# EAGLE schematic cv-pots (EAGLE 9.5.2)
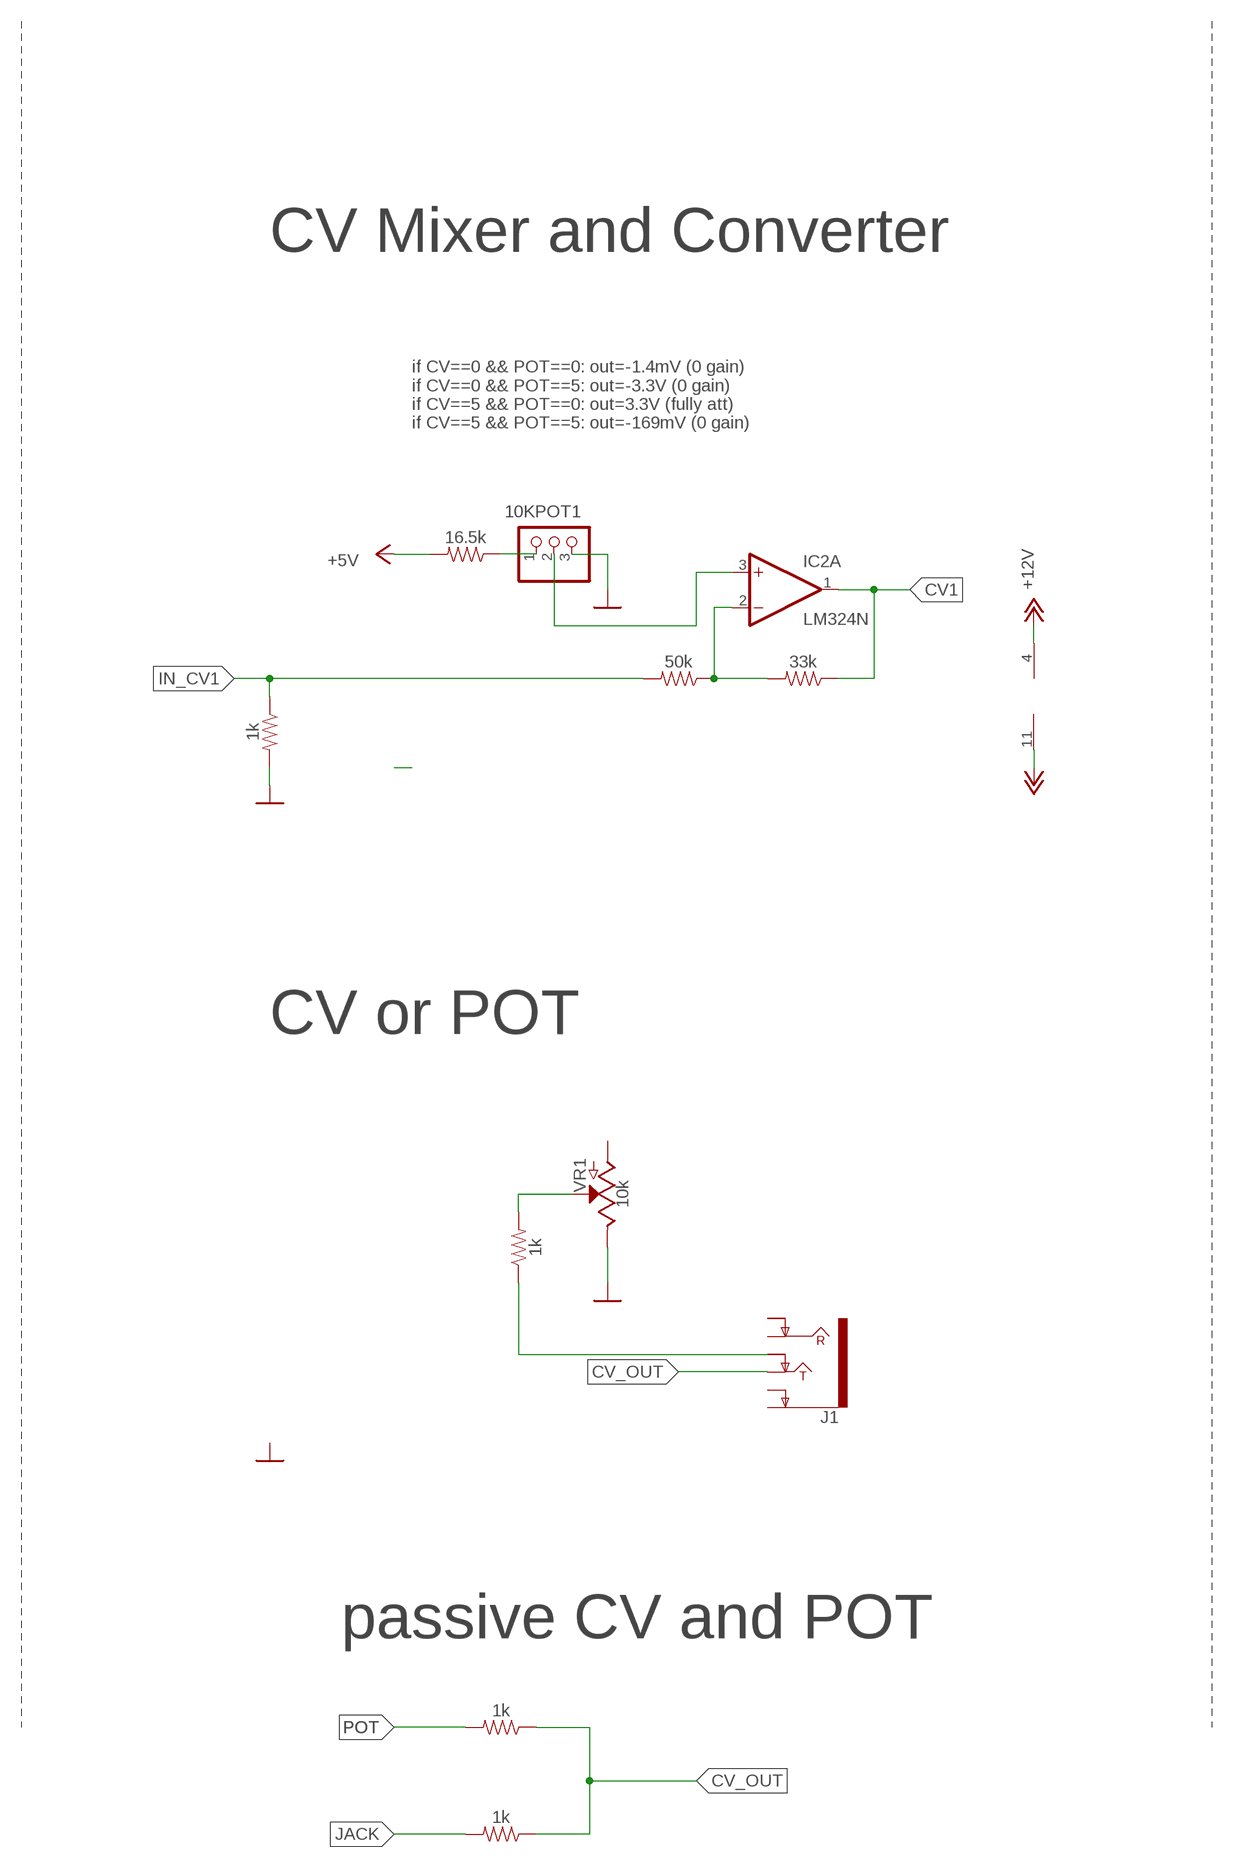
[diagram p0: schematic, sheet 1]

## Parts
10KPOT1  PINHD-1X3  [1X03]
IC2  LM324N  [DIL14]
J1  AUDIO_JACK_TRS_0.25"_PTH_RA  [AUDIO_JACK_0.25"_TRS_PTH_RA]
R1  1k  RESISTORAXIAL-0.3  [AXIAL-0.3]
R2  1k  RESISTORAXIAL-0.3  [AXIAL-0.3]
R3  1k  RESISTORAXIAL-0.3  [AXIAL-0.3]
R9  1k  RESISTORAXIAL-0.3  [AXIAL-0.3]
R18  16.5k  RESISTORAXIAL-0.3  [AXIAL-0.3]
R19  50k  RESISTORAXIAL-0.3  [AXIAL-0.3]
R20  33k  RESISTORAXIAL-0.3  [AXIAL-0.3]
VR1  10k  POTENTIOMETER-PTH-9MM-1/20W-20%  [POT-PTH-ALPS]

## Nets
+5V: R18.P$2
+12V: IC2.4(P:V+)
-12V: IC2.11(P:V-)
CV1: IC2.1(A:OUT) R20.P$1
CV_OUT: J1.TIP R2.P$1 R3.P$1
GND: 10KPOT1.3 R9.P$2 VR1.P$1(E)
IN_CV1: R9.P$1 R19.P$2
JACK: R3.P$2
N$2: R1.P$2 VR1.P$2(S)
N$3: J1.TIP-NORM R1.P$1
N$15: 10KPOT1.2 IC2.3(A:+IN)
N$16: 10KPOT1.1 R18.P$1
N$17: IC2.2(A:-IN) R19.P$1 R20.P$2
POT: R2.P$2
Unconnected: IC2.5(B:+IN) IC2.6(B:-IN) IC2.7(B:OUT) IC2.8(C:OUT) IC2.9(C:-IN) IC2.10(C:+IN) IC2.12(D:+IN) IC2.13(D:-IN) IC2.14(D:OUT) J1.RING J1.RING-NORM J1.SLEEVE(EARTH) J1.SLEEVE-NORM(EARTH-NORM) VR1.P$3(A)

## Notes on the sheet
- CV Mixer and Converter
- if CV==0 && POT==0: out=-1.4mV (0 gain)
  if CV==0 && POT==5: out=-3.3V (0 gain)
  if CV==5 && POT==0: out=3.3V (fully att)
  if CV==5 && POT==5: out=-169mV (0 gain)
- CV or POT
- passive CV and POT

## Library data of the parts
10KPOT1 = pinhead:PINHD-1X3: PIN HEADER
IC2 = linear:LM324: OP AMP
J1 = SparkFun-Connectors:AUDIO_JACK_TRS_0.25"_PTH_RA: Audio Jack, 1/4" TRS jack, horizontal, PTH, aka "Phono jack" Find the connector here: Audio Jack - 1/4" Stereo (right angle) <https://www.sparkfun.com/products/11144> (COM-11144) Datasheet <http://cdn.sparkfun.com/datasheets/Components/General/JP-611%20DD.jpg> Note, although the datasheet and physical part are slightly different, this footprint was proven to mate well on the Proto Pedal. This device is used on these SparkFun Products: SparkFun TRS Jack Breakout - 1/4" Stereo <https://www.sparkfun.com/products/13005> (BOB-13005 ) SparkFun Proto Pedal - sorry bad link - product comming soon! <https://www.sparkfun.com/products/13124> (PRT-13124); PROD_ID: CONN-12339; SF_ID: COM-11144
R1-R3 R9 R18-R20 = SparkFun-Resistors:RESISTOR: Generic Resistor Package
VR1 = SparkFun-Resistors:POTENTIOMETER: Potentiometer (Pot) Three-terminal potentiometers, with an adjustable wiper and two adjustable resistors. A pot can be used to create a configurable voltage divider, or as a variable resistor. Variants ALPS_POT and ALPS_POT_KIT - PTH, breadboard compatible, 9mm square pots Rotary Potentiometer - Linear (10k ohm) <https://www.sparkfun.com/products/9288> (COM-09288) The KIT variant exposes copper on only one side of the PTH pad, so the part can only be assembled on one side of the PCB. Useful for beginner soldering kits.; PROD_ID: RES-09177; SF_SKU: COM-09288